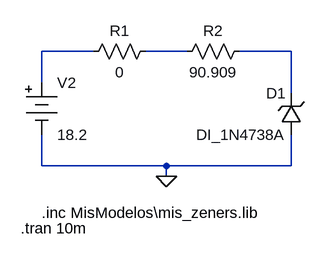
[diagram p0: schematic Zener1N4738ValoresNoComercialesCaso1.asc]
Zener1N4738ValoresNoComercialesCaso1.asc, the LTspice schematic file:
Version 4.1
SHEET 1 880 680
WIRE 48 96 -32 96
WIRE 192 96 128 96
WIRE 352 96 272 96
WIRE -32 144 -32 96
WIRE 352 160 352 96
WIRE -32 272 -32 224
WIRE 160 272 -32 272
WIRE 352 272 352 224
WIRE 352 272 160 272
WIRE 160 288 160 272
FLAG 160 288 0
SYMBOL Misc\\battery -32 128 R0
SYMATTR InstName V2
SYMATTR Value 18.2
SYMBOL res 144 80 R90
WINDOW 0 0 56 VBottom 2
WINDOW 3 32 56 VTop 2
SYMATTR InstName R1
SYMATTR Value 0
SYMBOL res 288 80 R90
WINDOW 0 0 56 VBottom 2
WINDOW 3 32 56 VTop 2
SYMATTR InstName R2
SYMATTR Value 90.909
SYMBOL zener 368 224 R180
WINDOW 0 24 64 Left 2
WINDOW 3 24 0 Left 2
SYMATTR InstName D1
SYMATTR Value DI_1N4738A
SYMATTR Prefix X
TEXT -32 344 Left 2 !.inc MisModelos\\mis_zeners.lib
TEXT -64 368 Left 2 !.tran 10m

The netlist it stands for:
* Zener1N4738ValoresNoComercialesCaso1.asc
V2 N001 0 18.2
R1 N002 N001 0
R2 N003 N002 90.909
X§D1 0 N003 DI_1N4738A  ; pins + -
.inc MisModelos\mis_zeners.lib
.tran 10m
.backanno
.end